# Altium schematic sheet Sheet1.SchDoc
size A3
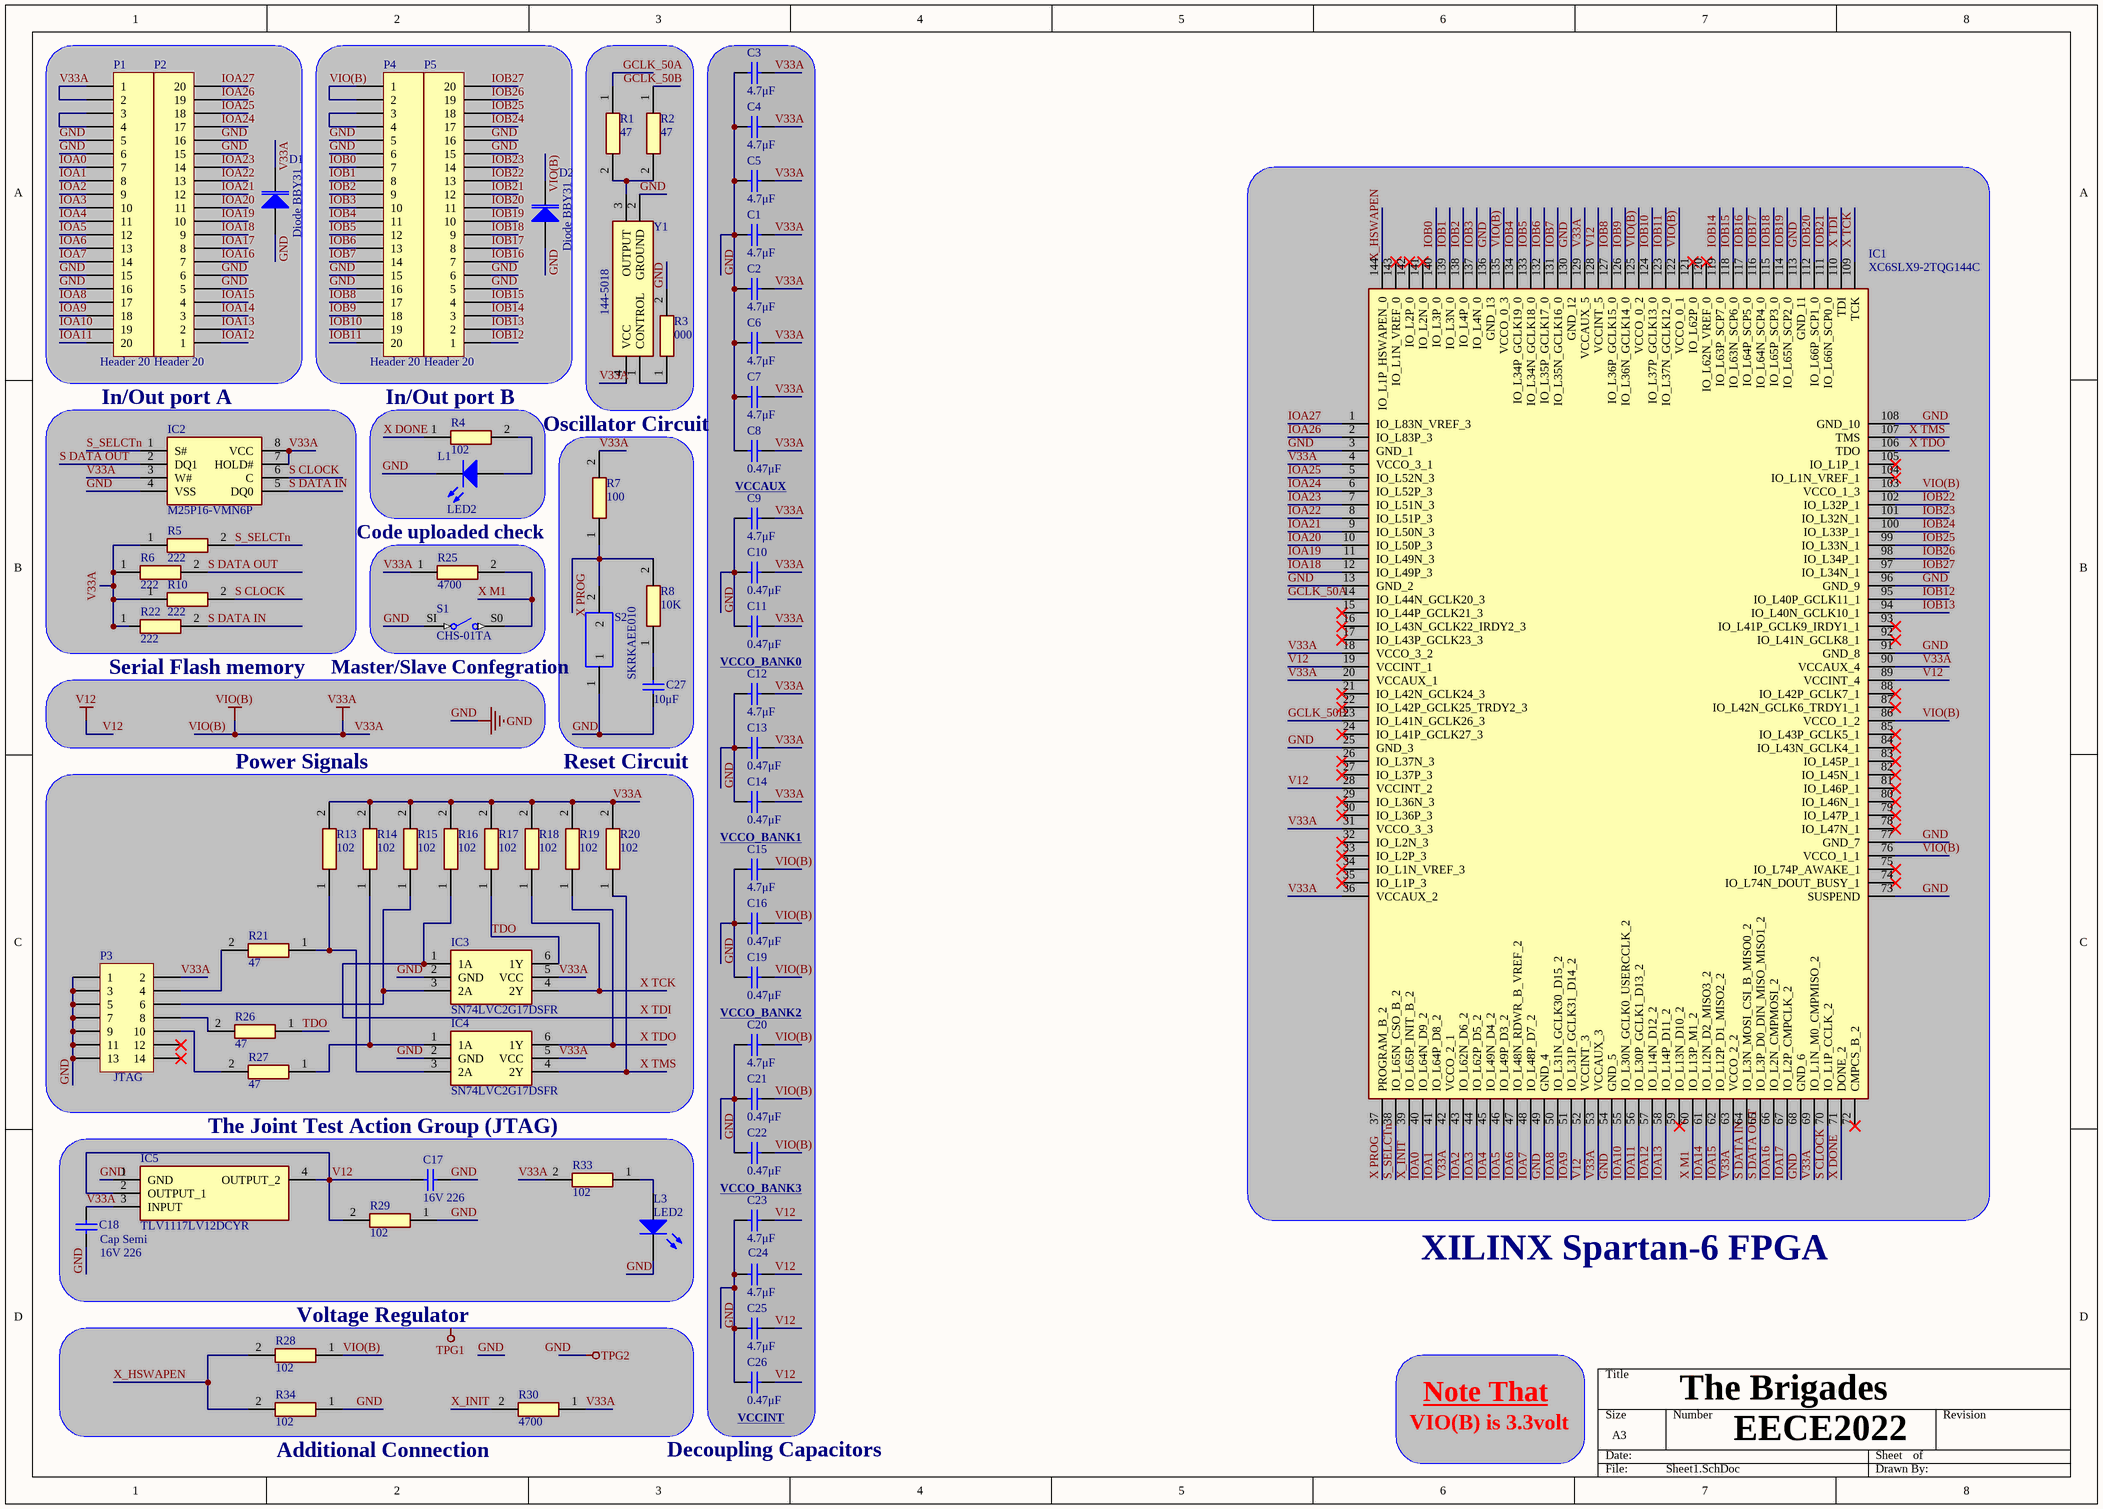
[diagram p0: Sheet1.SchDoc]

## Parts
C1  4.7μF  [0402]
C2  4.7μF  [0402]
C3  4.7μF  [0402]
C4  4.7μF  [0402]
C5  4.7μF  [0402]
C6  4.7μF  [0402]
C7  4.7μF  [0402]
C8  0.47μF  [0402]
C9  4.7μF  [0402]
C10  0.47μF  [0402]
C11  0.47μF  [0402]
C12  4.7μF  [0402]
C13  0.47μF  [0402]
C14  0.47μF  [0402]
C15  4.7μF  [0402]
C16  0.47μF  [0402]
C17  16V 226  [0402]
C18  Cap Semi  value 16V 226  [0402]
C19  0.47μF  [0402]
C20  4.7μF  [0402]
C21  0.47μF  [0402]
C22  0.47μF  [0402]
C23  4.7μF  [0402]
C24  4.7μF  [0402]
C25  4.7μF  [0402]
C26  0.47μF  [0402]
C27  10μF  [0402]
D1  Diode BBY31  [SOT23_N]
D2  Diode BBY31  [SOT23_N]
IC1  XC6SLX9-2TQG144C  [QFP50P2200X2200X160-144N]
IC2  M25P16-VMN6P  [SOIC127P600X175-8N]
IC3  SN74LVC2G17DSFR  [SON35P100X100X40-6N]
IC4  SN74LVC2G17DSFR  [SON35P100X100X40-6N]
IC5  TLV1117LV12DCYR  [SOT230P700X180-4N]
L1  LED2  [3.2X1.6X1.1]
L3  LED2  [3.2X1.6X1.1]
P1  Header 20  [HDR1X20]
P2  Header 20  [HDR1X20]
P3  JTAG  [HDR2X7H]
P4  Header 20  [HDR1X20]
P5  Header 20  [HDR1X20]
R1  47  [RESC0603X28N]
R2  47  [RESC0603X28N]
R3  000  [RESC0603X28N]
R4  102  [RESC0603X28N]
R5  222  [RESC0603X28N]
R6  222  [RESC0603X28N]
R7  100  [RESC0603X28N]
R8  10K  [RESC0603X28N]
R10  222  [RESC0603X28N]
R13  102  [RESC0603X28N]
R14  102  [RESC0603X28N]
R15  102  [RESC0603X28N]
R16  102  [RESC0603X28N]
R17  102  [RESC0603X28N]
R18  102  [RESC0603X28N]
R19  102  [RESC0603X28N]
R20  102  [RESC0603X28N]
R21  47  [RESC0603X28N]
R22  222  [RESC0603X28N]
R25  4700  [RESC0603X28N]
R26  47  [RESC0603X28N]
R27  47  [RESC0603X28N]
R28  102  [RESC0603X28N]
R29  102  [RESC0603X28N]
R30  4700  [RESC0603X28N]
R33  102  [RESC0603X28N]
R34  102  [RESC0603X28N]
S1  CHS-01TA  [CHS-01TA]
S2  SKRKAEE010  [SKRK]
Y1  144-5018  [1445018]

## Blocks framed on the sheet
In/Out port A: IC2 R5 R6 R10 R22
In/Out port B: L1 R4
Oscillator Circuit: C27 R7 R8 S2
Code uploaded check: R25 S1
The Joint Test Action Group (JTAG): C17 C18 IC5 L3 R29 R33
Voltage Regulator: R28 R30 R34

## Nets
GND: C1.1 C2.1 C3.1 C4.1 C5.1 C6.1 C7.1 C8.1 C9.1 C10.1 C11.1 C12.1 C13.1 C14.1 C15.1 C16.1 C17.1 C18.1 C19.1 C20.1 C21.1 C22.1 C23.1 C24.1 C25.1 C26.1 C27.1 D1.3(A) D2.3(A) IC1.3(GND_1) IC1.13(GND_2) IC1.25(GND_3) IC1.49(GND_4) IC1.54(GND_5) IC1.68(GND_6) IC1.73(SUSPEND) IC1.77(GND_7) IC1.91(GND_8) IC1.96(GND_9) IC1.108(GND_10) IC1.113(GND_11) IC1.130(GND_12) IC1.136(GND_13) IC2.4(VSS) IC3.2(GND) IC4.2(GND) IC5.1(GND) L1.2(K) L3.2(K) P1.5 P1.6 P1.15 P1.16 P2.5 P2.6 P2.15 P2.16 P3.1 P3.3 P3.5 P3.7 P3.9 P3.11 P3.13 P4.5 P4.6 P4.15 P4.16 P5.5 P5.6 P5.15 P5.16 R3.2 R29.1 R34.1 S1.SI(S!) S2.1 Y1.2(GROUND)  [also labelled TPG2]
V12: C17.2 C23.2 C24.2 C25.2 C26.2 IC1.19(VCCINT_1) IC1.28(VCCINT_2) IC1.52(VCCINT_3) IC1.89(VCCINT_4) IC1.128(VCCINT_5) IC5.2(OUTPUT_1) IC5.4(OUTPUT_2) R29.2
V33A: C1.2 C2.2 C3.2 C4.2 C5.2 C6.2 C7.2 C8.2 C9.2 C10.2 C11.2 C12.2 C13.2 C14.2 C15.2 C16.2 C18.2 C19.2 C20.2 C21.2 C22.2 D1.1(K) D2.1(K) IC1.4(VCCO_3_1) IC1.18(VCCO_3_2) IC1.20(VCCAUX_1) IC1.31(VCCO_3_3) IC1.36(VCCAUX_2) IC1.42(VCCO_2_1) IC1.53(VCCAUX_3) IC1.63(VCCO_2_2) IC1.69(IO_L1N_M0_CMPMISO_2) IC1.76(VCCO_1_1) IC1.86(VCCO_1_2) IC1.90(VCCAUX_4) IC1.103(VCCO_1_3) IC1.122(VCCO_0_1) IC1.125(VCCO_0_2) IC1.129(VCCAUX_5) IC1.135(VCCO_0_3) IC2.3(W#) IC2.7(HOLD#) IC2.8(VCC) IC3.5(VCC) IC4.5(VCC) IC5.3(INPUT) P1.1 P1.2 P3.2 P4.1 P4.2 R5.1 R6.1 R7.2 R10.1 R13.2 R14.2 R15.2 R16.2 R17.2 R18.2 R19.2 R20.2 R22.1 R25.1 R28.1 R30.1 R33.2 Y1.4(VCC)  [also labelled VIO(B)]
GCLK_50A: IC1.14(IO_L44N_GCLK20_3) R1.1
GCLK_50B: IC1.23(IO_L41N_GCLK26_3) R2.1
IOA0: IC1.40(IO_L64N_D9_2) P1.7
IOA1: IC1.41(IO_L64P_D8_2) P1.8
IOA2: IC1.43(IO_L62N_D6_2) P1.9
IOA3: IC1.44(IO_L62P_D5_2) P1.10
IOA4: IC1.45(IO_L49N_D4_2) P1.11
IOA5: IC1.46(IO_L49P_D3_2) P1.12
IOA6: IC1.47(IO_L48N_RDWR_B_VREF_2) P1.13
IOA7: IC1.48(IO_L48P_D7_2) P1.14
IOA8: IC1.50(IO_L31N_GCLK30_D15_2) P1.17
IOA9: IC1.51(IO_L31P_GCLK31_D14_2) P1.18
IOA10: IC1.55(IO_L30N_GCLK0_USERCCLK_2) P1.19
IOA11: IC1.56(IO_L30P_GCLK1_D13_2) P1.20
IOA12: IC1.57(IO_L14N_D12_2) P2.1
IOA13: IC1.58(IO_L14P_D11_2) P2.2
IOA14: IC1.61(IO_L12N_D2_MISO3_2) P2.3
IOA15: IC1.62(IO_L12P_D1_MISO2_2) P2.4
IOA16: IC1.66(IO_L2N_CMPMOSI_2) P2.7
IOA17: IC1.67(IO_L2P_CMPCLK_2) P2.8
IOA18: IC1.12(IO_L49P_3) P2.9
IOA19: IC1.11(IO_L49N_3) P2.10
IOA20: IC1.10(IO_L50P_3) P2.11
IOA21: IC1.9(IO_L50N_3) P2.12
IOA22: IC1.8(IO_L51P_3) P2.13
IOA23: IC1.7(IO_L51N_3) P2.14
IOA24: IC1.6(IO_L52P_3) P2.17
IOA25: IC1.5(IO_L52N_3) P2.18
IOA26: IC1.2(IO_L83P_3) P2.19
IOA27: IC1.1(IO_L83N_VREF_3) P2.20
IOB0: IC1.140(IO_L3P_0) P4.7
IOB1: IC1.139(IO_L3N_0) P4.8
IOB2: IC1.138(IO_L4P_0) P4.9
IOB3: IC1.137(IO_L4N_0) P4.10
IOB4: IC1.134(IO_L34P_GCLK19_0) P4.11
IOB5: IC1.133(IO_L34N_GCLK18_0) P4.12
IOB6: IC1.132(IO_L35P_GCLK17_0) P4.13
IOB7: IC1.131(IO_L35N_GCLK16_0) P4.14
IOB8: IC1.127(IO_L36P_GCLK15_0) P4.17
IOB9: IC1.126(IO_L36N_GCLK14_0) P4.18
IOB10: IC1.124(IO_L37P_GCLK13_0) P4.19
IOB11: IC1.123(IO_L37N_GCLK12_0) P4.20
IOB12: IC1.95(IO_L40P_GCLK11_1) P5.1
IOB13: IC1.94(IO_L40N_GCLK10_1) P5.2
IOB14: IC1.119(IO_L63P_SCP7_0) P5.3
IOB15: IC1.118(IO_L63N_SCP6_0) P5.4
IOB16: IC1.117(IO_L64P_SCP5_0) P5.7
IOB17: IC1.116(IO_L64N_SCP4_0) P5.8
IOB18: IC1.115(IO_L65P_SCP3_0) P5.9
IOB19: IC1.114(IO_L65N_SCP2_0) P5.10
IOB20: IC1.112(IO_L66P_SCP1_0) P5.11
IOB21: IC1.111(IO_L66N_SCP0_0) P5.12
IOB22: IC1.102(IO_L32P_1) P5.13
IOB23: IC1.101(IO_L32N_1) P5.14
IOB24: IC1.100(IO_L33P_1) P5.17
IOB25: IC1.99(IO_L33N_1) P5.18
IOB26: IC1.98(IO_L34P_1) P5.19
IOB27: IC1.97(IO_L34N_1) P5.20
S CLOCK: IC1.70(IO_L1P_CCLK_2) IC2.6(C) R10.2
S DATA IN: IC1.64(IO_L3N_MOSI_CSI_B_MISO0_2) IC2.5(DQ0) R22.2
S DATA OUT: IC1.65(IO_L3P_D0_DIN_MISO_MISO1_2) IC2.2(DQ1) R6.2
S_SELCTn: IC1.38(IO_L65N_CSO_B_2) IC2.1(S#) R5.2
TDO: IC3.6(1Y) R17.1 R26.1
X DONE: IC1.71(DONE_2) R4.1
X M1: IC1.60(IO_L13P_M1_2) R25.2 S1.S0(SO)
X PROG: IC1.37(PROGRAM_B_2) R7.1 R8.2 S2.2
X TCK: IC1.109(TCK) IC3.4(2Y) R18.1
X TDI: IC1.110(TDI) IC3.1(1A) R16.1
X TDO: IC1.106(TDO) IC4.6(1Y) R19.1
X TMS: IC1.107(TMS) IC4.4(2Y) R20.1
X_HSWAPEN: IC1.144(IO_L1P_HSWAPEN_0) R28.2 R34.2
X_INIT: IC1.39(IO_L65P_INIT_B_2) R30.2
NetC27_2: C27.2 R8.1
NetIC3_3: IC3.3(2A) P3.6 R15.1
NetIC4_1: IC4.1(1A) R14.1 R27.1
NetIC4_3: IC4.3(2A) R13.1 R21.1
NetL1_1: L1.1(A) R4.2
NetL3_1: L3.1(A) R33.1
NetP1_3: P1.3 P1.4
NetP3_4: P3.4 R21.2
NetP3_8: P3.8 R26.2
NetP3_10: P3.10 R27.2
NetP4_3: P4.3 P4.4
NetR1_2: R1.2 R2.2 Y1.3(OUTPUT)
NetR3_1: R3.1 Y1.1(CONTROL)

Not connected (* = marked no-connect by the designer): IC1 15(IO_L44P_GCLK21_3)* 16(IO_L43N_GCLK22_IRDY2_3)* 17(IO_L43P_GCLK23_3)* 21(IO_L42N_GCLK24_3)* 22(IO_L42P_GCLK25_TRDY2_3)* 24(IO_L41P_GCLK27_3)* 26(IO_L37N_3)* 27(IO_L37P_3)* 29(IO_L36N_3)* 30(IO_L36P_3)* 32(IO_L2N_3)* 33(IO_L2P_3)* 34(IO_L1N_VREF_3)* 35(IO_L1P_3)* 59(IO_L13N_D10_2)* 72(CMPCS_B_2)* 74(IO_L74N_DOUT_BUSY_1)* 75(IO_L74P_AWAKE_1)* 78(IO_L47N_1)* 79(IO_L47P_1)* 80(IO_L46N_1)* 81(IO_L46P_1)* 82(IO_L45N_1)* 83(IO_L45P_1)* 84(IO_L43N_GCLK4_1)* 85(IO_L43P_GCLK5_1)* 87(IO_L42N_GCLK6_TRDY1_1)* 88(IO_L42P_GCLK7_1)* 92(IO_L41N_GCLK8_1)* 93(IO_L41P_GCLK9_IRDY1_1)* 104(IO_L1N_VREF_1)* 105(IO_L1P_1)* 120(IO_L62N_VREF_0)* 121(IO_L62P_0)* 141(IO_L2N_0)* 142(IO_L2P_0)* 143(IO_L1N_VREF_0)*; P3 12* 14*

## Notes on the sheet
- VCCAUX
- VCCO_BANK0
- (near R22) Serial Flash memory
- Master/Slave Confegration
- Power Signals
- Reset Circuit
- VCCO_BANK1
- VCCO_BANK2
- VCCO_BANK3
- XILINX Spartan-6 FPGA
- Additional Connection
- Decoupling Capacitors
- (near C26) VCCINT
- VIO(B) is 3.3volt
- Note That
- The Brigades
- EECE2022
- Labels drawn without touching a wire or pin: TPG1

## Library data of the parts
C1-C27 = Cap Semi: Capacitor (Semiconductor SIM Model); Published: 8-Jun-2000; LatestRevisionDate: 29-May-2009; LatestRevisionNote: IPC-7351 Footprint Added.; PackageReference: C1206; Publisher: Altium Limited; PackageDescription: Chip Capacitor
D1 D2 = Diode BBY31: SOT23 Silicon Planar Variable Capacitance Diode; Note: Pin 2 is not connected and not drawn.; Published: 8-Jun-2000; LatestRevisionDate: 29-May-2009; LatestRevisionNote: IPC-7351 Footprint Added.; DatasheetVersion: Jan-1998; PackageVersion: 1996; PackageReference: SOT23; Publisher: Altium Limited; PackageDescription: 3-Pin SOT-23 Package 0.95 mm Pitch, 2.3 mm Lead Span - Reverse Pinning; ComponentLink1Description: Manufacturer Link; ComponentLink1URL: http://www.zetex.com/; ComponentLink2Description: Datasheet; ComponentLink2URL: www.zetex.com/3.0/pdf/BBY31.pdf
IC1 = XC6SLX9-2TQG144C: Integrated Circuit; Manufacturer_Name: XILINX; Datasheet Link: https://www.xilinx.com/support/documentation/data_sheets/ds160.pdf; Height: 1.6mm; Manufacturer_Part_Number: XC6SLX9-2TQG144C; Mouser Part Number: 217-XC6SLX9-2TQG144C; Mouser Price/Stock: https://www.mouser.com/Search/Refine.aspx?Keyword=217-XC6SLX9-2TQG144C; RS Part Number: 7276011P; RS Price/Stock: http://uk.rs-online.com/web/p/products/7276011P
IC2 = M25P16-VMN6P: Integrated Circuit; Manufacturer_Name: Micron; Datasheet Link: https://www.micron.com/~/media/documents/products/data-sheet/nor-flash/serial-nor/m25p/m25p16.pdf; Height: 1.75mm; Manufacturer_Part_Number: M25P16-VMN6P; Mouser Part Number: 340-180484; Mouser Price/Stock: https://www.mouser.com/Search/Refine.aspx?Keyword=340-180484; RS Part Number: 7824601P; RS Price/Stock: http://uk.rs-online.com/web/p/products/7824601P
IC3 IC4 = SN74LVC2G17DSFR: Integrated Circuit; Manufacturer_Name: Texas Instruments; Datasheet Link: http://www.ti.com/lit/gpn/sn74lvc2g17; Height: 0.4mm; Manufacturer_Part_Number: SN74LVC2G17DSFR; Mouser Part Number: 595-SN74LVC2G17DSFR; Mouser Price/Stock: https://www.mouser.com/Search/Refine.aspx?Keyword=595-SN74LVC2G17DSFR
IC5 = TLV1117LV12DCYR: Integrated Circuit; Manufacturer_Name: Texas Instruments; Datasheet Link: http://www.ti.com/lit/gpn/tlv1117lv; Height: 1.8mm; Manufacturer_Part_Number: TLV1117LV12DCYR; Mouser Part Number: 595-TLV1117LV12DCYR; Mouser Price/Stock: https://www.mouser.com/Search/Refine.aspx?Keyword=595-TLV1117LV12DCYR; RS Part Number: 8253628P; RS Price/Stock: http://uk.rs-online.com/web/p/products/8253628P
L1 L3 = LED2: Typical RED, GREEN, YELLOW, AMBER GaAs LED; Published: 8-Jun-2000; LatestRevisionDate: 17-Jul-2002; LatestRevisionNote: Re-released for DXP Platform.; PackageVersion: Feb-2002; PackageReference: 3.2X1.6X1.1; Publisher: Altium Limited; PackageDescription: SM LED; 2 Flat Leads
P1 P2 P4 P5 = Header 20: Header, 20-Pin; LatestRevisionDate: 17-Jul-2002; LatestRevisionNote: Re-released for DXP Platform.; Publisher: Altium Limited
P3 = Header 7X2H: Header, 7-Pin, Dual row, Right Angle; LatestRevisionDate: 17-Jul-2002; LatestRevisionNote: Re-released for DXP Platform.; Publisher: Altium Limited
R1-R8 R10 R13-R22 R25-R30 R33 R34 = CPF0201D100RE1: Resistor; Manufacturer_Name: TE Connectivity; Datasheet Link: http://www.te.com/commerce/DocumentDelivery/DDEController?Action=showdoc&DocId=Data+Sheet%7F1773200-1%7FA%7Fpdf%7FEnglish%7FENG_DS_1773200-1_A.pdf%7F4-2176215-6; Height: 0.28mm; Manufacturer_Part_Number: CPF0201D100RE1; Mouser Part Number: 279-CPF0201D100RE1; Mouser Price/Stock: https://www.mouser.com/Search/Refine.aspx?Keyword=279-CPF0201D100RE1; RS Part Number: 7549192; RS Price/Stock: http://uk.rs-online.com/web/p/products/7549192
S1 = CHS-01TA: Dip Switch SPST 1 Position Surface Mount Slide _Standard_ Actuator 100mA 6VDC; MF: Nidec Copal; Value: *; SnapEDA_Link: https://www.snapeda.com/parts/CHS-01TA/Nidec%20Copal%20Electronics/view-part/2873101/?ref=snap; Price: None; Availability: Unavailable; Package: None; MP: CHS-01TA
S2 = SKRKAEE010: Switch Tactile N.O. SPST Round Button Gull Wing 0.05A 12VDC 1.57N SMD T/R; MF: ALPS; Availability: Unavailable; Price: None; Package: None; Value: *; SnapEDA_Link: https://www.snapeda.com/parts/SKRKAEE010/ALPS/view-part/380772/?ref=snap; MP: SKRKAEE010
Y1 = 144-5018: Crystal or Oscillator; Manufacturer_Name: RS Components; Datasheet Link: https://docs-emea.rs-online.com/webdocs/15dc/0900766b815dc7b7.pdf; Height: 1.1mm; Manufacturer_Part_Number: 144-5018